# EAGLE design simreader_marble_hammi_CH340 (EAGLE 6.6.0)
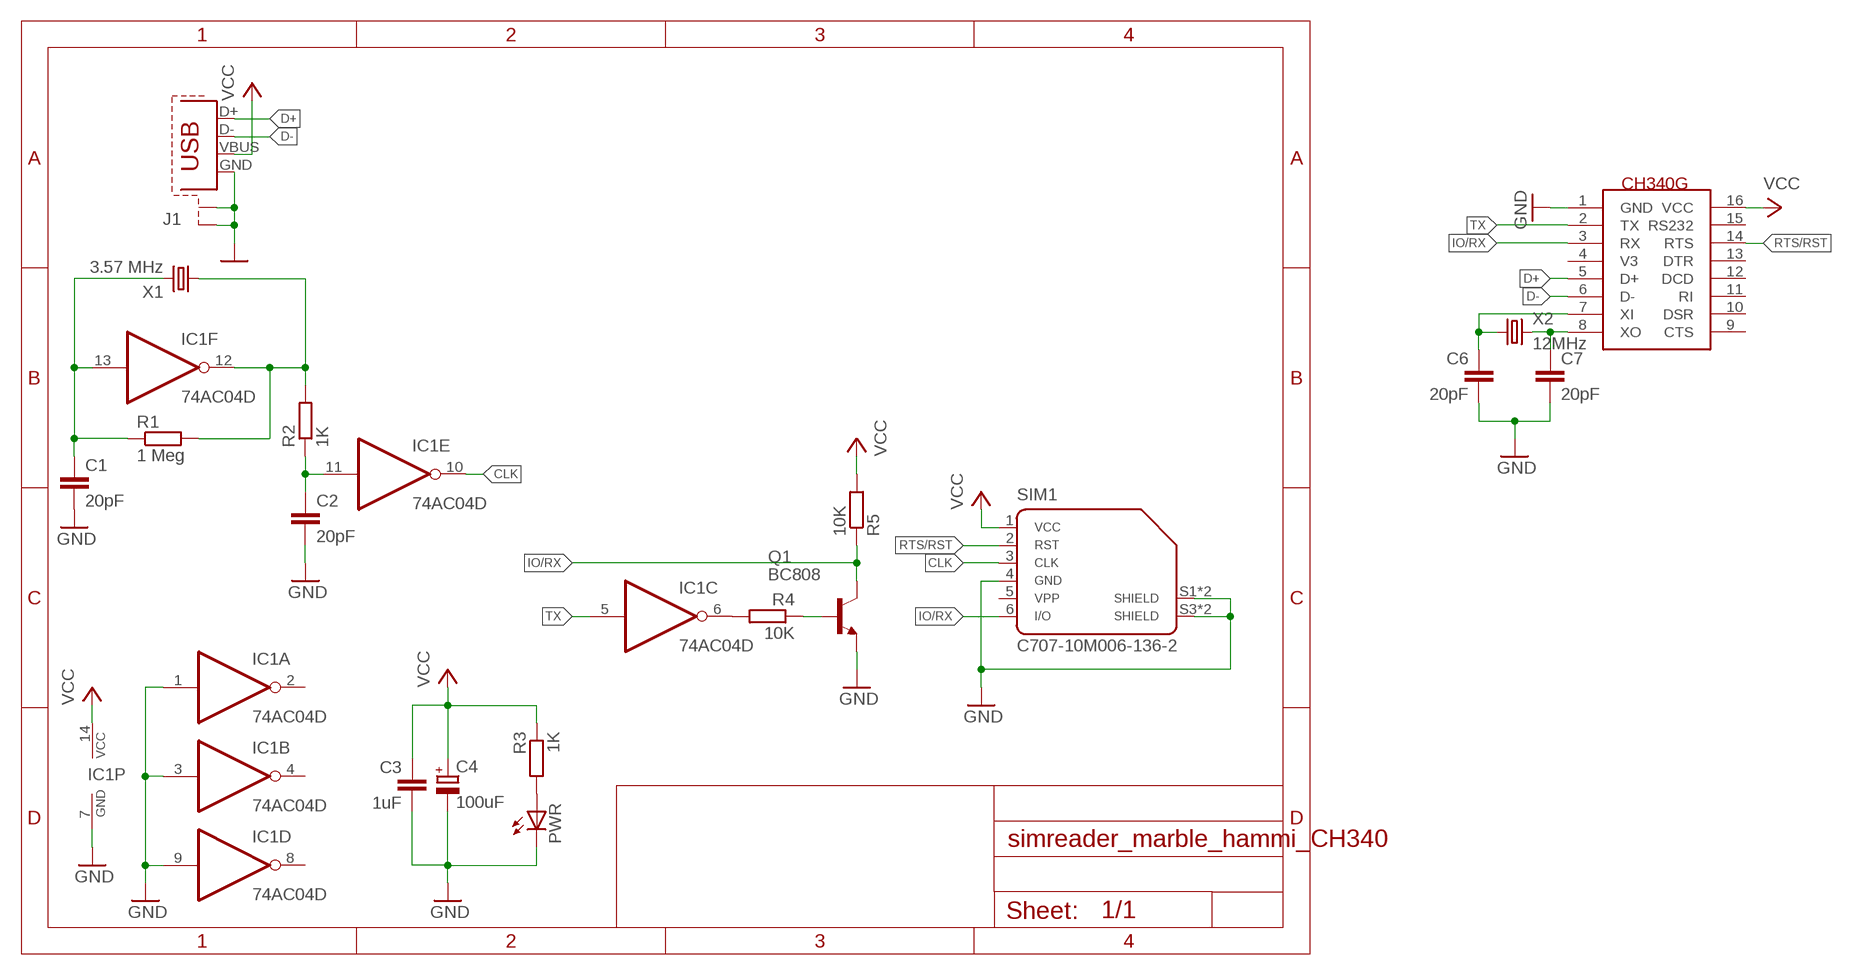
[diagram p0: schematic, sheet 1]

## Parts
C1  20pF  C-EUC0603  [C0603]
C2  20pF  C-EUC0603  [C0603]
C3  1uF  C-EUC0603  [C0603]
C4  100uF  CPOL-EU140CLH-0810  [140CLH-0810]
C6  20pF  C-EUC0603  [C0603]
C7  20pF  C-EUC0603  [C0603]
IC1  74AC04D  [SO14]
IC2  CH340G  [CH340G]
J1  USB-SHIELD-A-H  [USB-A-H]
PWR  LEDCHIPLED_0603  [CHIPLED_0603]
Q1  BC808  BC808-NPN-SOT23-BEC  [SOT23-BEC]
R1  1 Meg  R-EU_R0603  [R0603]
R2  1K  R-EU_R0603  [R0603]
R3  1K  R-EU_R0603  [R0603]
R4  10K  R-EU_R0603  [R0603]
R5  10K  R-EU_R0603  [R0603]
SIM1  C707-10M006-136-2  [C707_10M006_136_2]
X1  3.57 MHz  CRYSTALHC49UP  [HC49UP]
X2  12MHz  CRYSTALHC49UP  [HC49UP]

## Nets
CLK: IC1.10(E:O) SIM1.3
D+: IC2.5(D+) J1.D+
D-: IC2.6(D-) J1.D-
GND: C1.2 C2.2 C3.2 C4.- C6.2 C7.2 IC1.1(A:I) IC1.3(B:I) IC1.7(P:GND) IC1.9(D:I) IC2.1(GND) J1.GND J1.GND2(S1) J1.GND3(S2) PWR.C Q1.E SIM1.4 SIM1.S1 SIM1.S2(S1) SIM1.S3(S2) SIM1.S4(S2)
IO/RX: IC2.3(RX) Q1.C R5.1 SIM1.6
N$1: C1.1 IC1.13(F:I) R1.1 X1.2
N$2: IC1.12(F:O) R1.2 R2.2 X1.1
N$3: C2.1 IC1.11(E:I) R2.1
N$4: IC1.6(C:O) R4.2
N$6: Q1.B R4.1
N$13: PWR.A R3.2
N$26: C6.1 IC2.7(XI) X2.1
N$27: C7.1 IC2.8(XO) X2.2
RTS/RST: IC2.14(RTS) SIM1.2
TX: IC1.5(C:I) IC2.2(TX)
VCC: C3.1 C4.+ IC1.14(P:VCC) IC2.16(VCC) J1.VBUS R3.1 R5.2 SIM1.1
Unconnected: IC1.2(A:O) IC1.4(B:O) IC1.8(D:O) IC2.4(V3) IC2.9(CTS) IC2.10(DSR) IC2.11(RI) IC2.12(DCD) IC2.13(DTR) IC2.15(RS232) SIM1.5

## Library data of the parts
C1-C3 C6 C7 = rcl:C-EU: CAPACITOR, European symbol
C4 = rcl:CPOL-EU: POLARIZED CAPACITOR, European symbol
IC1 = 74xx-eu:74*04: Hex INVERTER
IC2 = dan:CH340G
J1 = obddiag-net:USB-SHIELD
PWR = led:LED: LED OSRAM: - CHIPLED LG R971, LG N971, LY N971, LG Q971, LY Q971, LO R971, LY R971 LH N974, LH R974 LS Q976, LO Q976, LY Q976 LO Q996 - Hyper CHIPLED LW Q18S LB Q993, LB Q99A, LB R99A - SideLED LS A670, LO A670, LY A670, LG A670, LP A670 LB A673, LV A673, LT A673, LW A673 LH A674 LY A675 LS A676, LA A676, LO A676, LY A676, LW A676 LS A679, LY A679, LG A679 - Hyper Micro SIDELED® LS Y876, LA Y876, LO Y876, LY Y876 LT Y87S - SmartLED LW L88C, LW L88S LB L89C, LB L89S, LG L890 LS L89K, LO L89K, LY L89K LS L896, LA L896, LO L896, LY L896 - TOPLED LS T670, LO T670, LY T670, LG T670, LP T670 LSG T670, LSP T670, LSY T670, LOP T670, LYG T670 LG T671, LOG T671, LSG T671 LB T673, LV T673, LT T673, LW T673 LH T674 LS T676, LA T676, LO T676, LY T676, LB T676, LH T676, LSB T676, LW T676 LB T67C, LV T67C, LT T67C, LS T67K, LO T67K, LY T67K, LW E67C LS E67B, LA E67B, LO E67B, LY E67B, LB E67C, LV E67C, LT E67C LW T67C LS T679, LY T679, LG T679 LS T770, LO T770, LY T770, LG T770, LP T770 LB T773, LV T773, LT T773, LW T773 LH T774 LS E675, LA E675, LY E675, LS T675 LS T776, LA T776, LO T776, LY T776, LB T776 LHGB T686 LT T68C, LB T68C - Hyper Mini TOPLED® LB M676 - Mini TOPLED Santana® LG M470 LS M47K, LO M47K, LY M47K Source: http://www.osram.convergy.de LUXEON: - LUMILED® LXK2-PW12-R00, LXK2-PW12-S00, LXK2-PW14-U00, LXK2-PW14-V00 LXK2-PM12-R00, LXK2-PM12-S00, LXK2-PM14-U00 LXK2-PE12-Q00, LXK2-PE12-R00, LXK2-PE12-S00, LXK2-PE14-T00, LXK2-PE14-U00 LXK2-PB12-K00, LXK2-PB12-L00, LXK2-PB12-M00, LXK2-PB14-N00, LXK2-PB14-P00, LXK2-PB14-Q00 LXK2-PR12-L00, LXK2-PR12-M00, LXK2-PR14-Q00, LXK2-PR14-R00 LXK2-PD12-Q00, LXK2-PD12-R00, LXK2-PD12-S00 LXK2-PH12-R00, LXK2-PH12-S00 LXK2-PL12-P00, LXK2-PL12-Q00, LXK2-PL12-R00 Source: www.luxeon.com KINGBRIGHT: KA-3528ASYC Source: www.kingbright.com
Q1 = transistor:*-NPN-: NPN Transistror BF959 corrected 2008.03.06
R1-R5 = rcl:R-EU_: RESISTOR, European symbol
SIM1 = con-amphenol:C707-10M006-136-2
X1 X2 = crystal:CRYSTAL: CRYSTAL; OC_FARNELL: unknown; OC_NEWARK: unknown

## Board
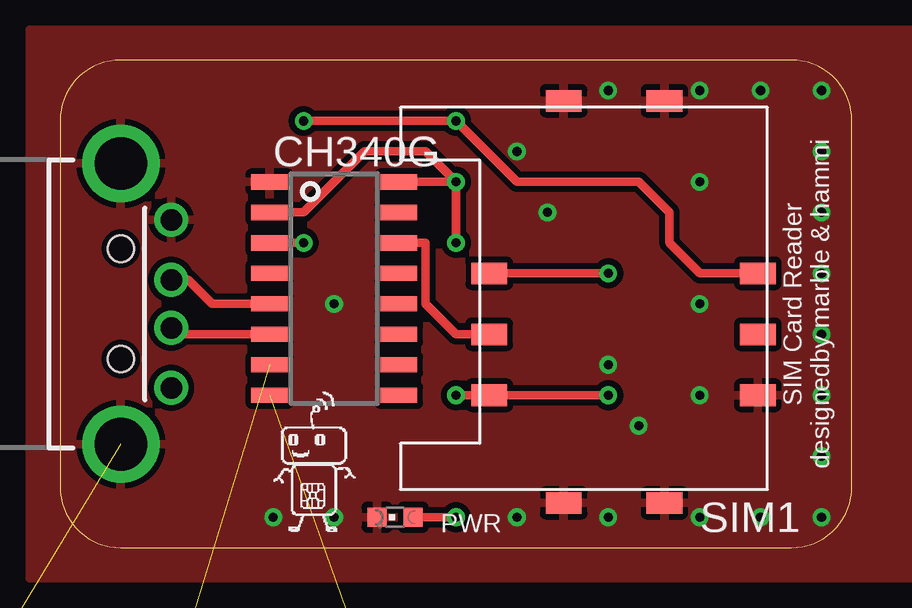
[diagram p1: board, top side]
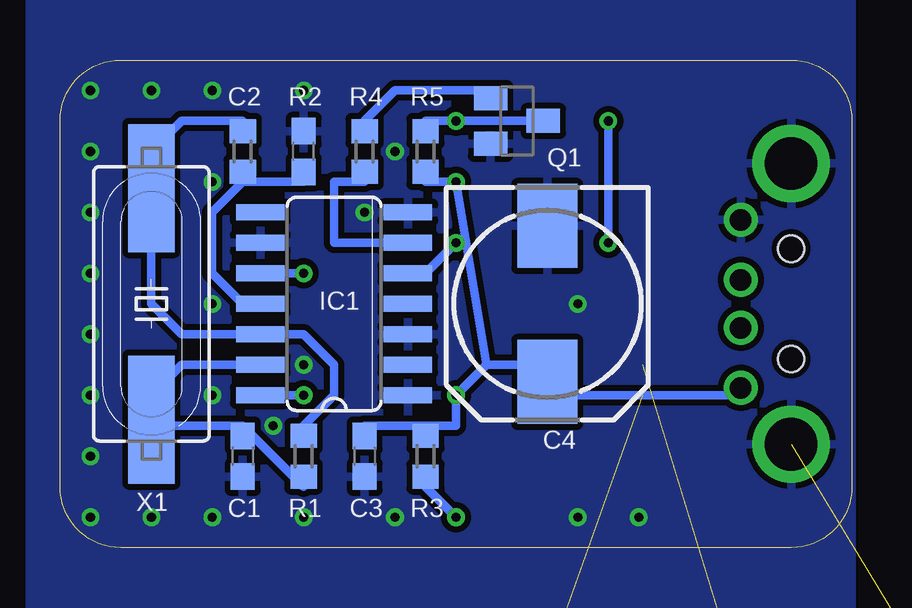
[diagram p2: board, bottom side, seen from below]

Size 33.02 x 20.32 mm. Coordinates in mm from the lower left corner, seen from the top.
Outline: 0,17.78 0,2.54 arc90 2.54,0 30.48,0 arc90 33.02,2.54 33.02,17.78 arc90 30.48,20.32 2.54,20.32 arc90 0,17.78
Copper layers (1*16): Top 0.035mm / dielectric 1.5mm / Bottom 0.035mm
Design rules "oshpark": minimum track width 6mil, minimum drill 13mil, track to track 6mil, track to pad 6mil, pad to pad 6mil, via to via 6mil, smd to smd 6mil, copper to edge 0mil, drill to drill 8mil, minimum pad ring 10mil, minimum via ring 7mil, stop-mask expansion 4mil, vias tented up to drill 100mil, thermal gap 10mil

### Footprints (pad centres in the part's own frame; a part is rotated, then mirrored left to right if it is on the bottom)
C0603 = smd 1.1 x 1: 1 -0.85,0; 2 0.85,0
140CLH-0810 = smd 3.5 x 2.5: + 3.25,0; - -3.25,0
SO14 = smd 0.66 x 2.032: 1 -3.81,-3.073; 2 -2.54,-3.073; 3 -1.27,-3.073; 4 0,-3.073; 5 1.27,-3.073; 6 2.54,-3.073; 7 3.81,-3.073; 8 3.81,3.073; 9 2.54,3.073; 10 1.27,3.073; 11 0,3.073; 12 -1.27,3.073; 13 -2.54,3.073; 14 -3.81,3.073
CH340G = smd 0.635 x 1.524: 1 -4.445,-2.695; 2 -3.175,-2.695; 3 -1.905,-2.695; 4 -0.635,-2.695; 5 0.635,-2.695; 6 1.905,-2.695; 7 3.175,-2.695; 8 4.445,-2.695; 9 4.445,2.695; 10 3.175,2.695; 11 1.905,2.695; 12 0.635,2.695; 13 -0.635,2.695; 14 -1.905,2.695; 15 -3.175,2.695; 16 -4.445,2.695
USB-A-H = drill 0.9: D+ 2.1,1; D- 2.1,-1; GND 2.1,3.5; VBUS 2.1,-3.5 | drill 2.2: GND2 0,-5.85; GND3 0,5.85 | hole 1.1: 0,2.3; 0,-2.3
CHIPLED_0603 = smd 0.8 x 0.8: A 0,-0.75; C 0,0.75
SOT23-BEC = smd 1 x 1.4: B -0.95,-1.1; C 0,1.1; E 0.95,-1.1
R0603 = smd 1 x 1.1: 1 -0.85,0; 2 0.85,0
C707_10M006_136_2 = smd 1.49 x 0.9: 1 4.965,2.54; 2 4.965,0; 3 4.965,-2.54; 4 -6.235,2.54; 5 -6.235,0; 6 -6.235,-2.54; S1 -2.335,7.02; S2 1.865,7.02; S3 -2.335,-9.73; S4 1.865,-9.73
HC49UP = smd 5.334 x 1.93: 1 -4.826,0; 2 4.826,0

### Placement (x,y rotation side)
C1  25.4,3.81 270 bottom
C2  22.86,16.51 90 bottom
C3  20.32,3.81 270 bottom
C4  12.7,10.16 270 bottom
C6  -10.16,-15.24 0 top  (outside the outline)
C7  -10.16,-20.32 0 top  (outside the outline)
IC1  21.59,10.16 90 bottom
IC2  11.43,10.79 270 top
J1  2.54,10.16 0 top
PWR  13.97,1.27 90 top
Q1  13.97,17.78 270 bottom
R1  22.86,3.81 90 bottom
R2  25.4,16.51 90 bottom
R3  17.78,3.81 270 bottom
R4  20.32,16.51 270 bottom
R5  17.78,16.51 270 bottom
SIM1  22.86,8.89 180 top
X1  29.21,10.16 270 bottom
X2  8.89,-7.62 0 top  (outside the outline)

### Tracks (layer width: path | path; a pad name or v marks a point on that pad's centre or on a via)
CLK  (via drill 0.38)
  Top 0.356: v22.86,11.43 SIM1.3
  Bottom 0.356: IC1.10 v22.86,11.43
D+
  Top 0.356: J1.D+ 5.35,11.16 6.35,10.16 IC2.5
D-
  Top 0.356: J1.D- 4.81,9.16 5.08,8.89 IC2.6
GND  (via drill 0.38)  (2 unrouted)
  other vias: 22.86,7.62 24.13,5.08 26.67,6.35 26.67,15.24 26.67,10.16 8.89,1.27 31.75,1.27 31.75,19.05 22.86,1.27 22.86,19.05 26.67,1.27 26.67,19.05 19.05,1.27 29.21,19.05 31.75,16.51 31.75,13.97 31.75,11.43 31.75,8.89 31.75,6.35 31.75,3.81 29.21,1.27 19.05,16.51 20.32,13.97 11.43,10.16 11.43,1.27
  pour Top (isolate 0.254): -1.27,-1.27 35.56,-1.27 35.56,21.59 -1.27,21.59
  pour Bottom (isolate 0.254): 0,-2.54 34.29,-2.54 34.29,22.86 0,22.86
IO/RX  (via drill 0.38)
  Top 0.356: SIM1.6 26.67,11.43 25.4,12.7 25.4,13.97 24.13,15.24 19.05,15.24 v16.51,17.78 v10.16,17.78 | v10.16,12.7 IC2.3
  Bottom 0.356: Q1.C v16.51,17.78 17.78,17.78 R5.1 | v10.16,17.78 v10.16,12.7
N$1
  Bottom 0.356: 25.4,5.08 29.21,5.08 X1.2 29.21,6.35 27.94,7.62 IC1.13 | R1.1 22.86,2.54 25.4,5.08 | 25.4,5.08 C1.1
N$2
  Bottom 0.356: R1.2 22.86,5.08 21.59,6.35 21.59,7.62 22.86,8.89 IC1.12 27.94,8.89 29.21,10.16 X1.1 29.21,16.51 27.94,17.78 25.4,17.78 R2.2
N$3
  Bottom 0.356: IC1.11 25.4,10.16 26.67,11.43 26.67,13.97 25.4,15.24 | C2.1 22.86,15.24 25.4,15.24 | R2.1 25.4,15.24
N$4
  Bottom 0.356: IC1.6 21.59,12.7 21.59,15.24 20.32,15.24 R4.2
N$6
  Bottom 0.356: R4.1 20.32,17.78 19.05,19.05 15.24,19.05 15.07,18.88 Q1.B
N$13  (via drill 0.38)
  Top 0.356: PWR.A v16.51,1.27
  Bottom 0.356: R3.2 17.78,2.54 v16.51,1.27
N$26  (2 unrouted)
N$27  (2 unrouted)
RTS/RST
  Top 0.356: SIM1.2 16.51,8.89 15.24,10.16 15.24,12.7 IC2.14
TX  (via drill 0.38)
  Top 0.356: IC2.2 10.16,13.97 12.7,16.51 15.24,16.51 16.51,15.24 v16.51,12.7
  Bottom 0.356: v16.51,12.7 17.78,11.43 IC1.5
VCC  (via drill 0.38)
  Top 0.356: v16.51,6.35 SIM1.1 v22.86,6.35 | IC2.16 v16.51,15.24
  Bottom 0.356: IC1.14 v22.86,6.35 | C3.1 20.32,5.08 17.78,5.08 | 17.78,5.08 R3.1 | 15.24,7.62 12.7,7.62 C4.+ 12.7,6.35 4.95,6.35 J1.VBUS | 17.78,5.08 16.51,5.08 v16.51,6.35 15.24,7.62 | 15.24,7.62 v16.51,15.24 17.78,15.24 R5.2

### Text on the board
tNames: SIM Card Reader / designedby marble & hammi